# EAGLE design INJ4SS (EAGLE 6.5.0)
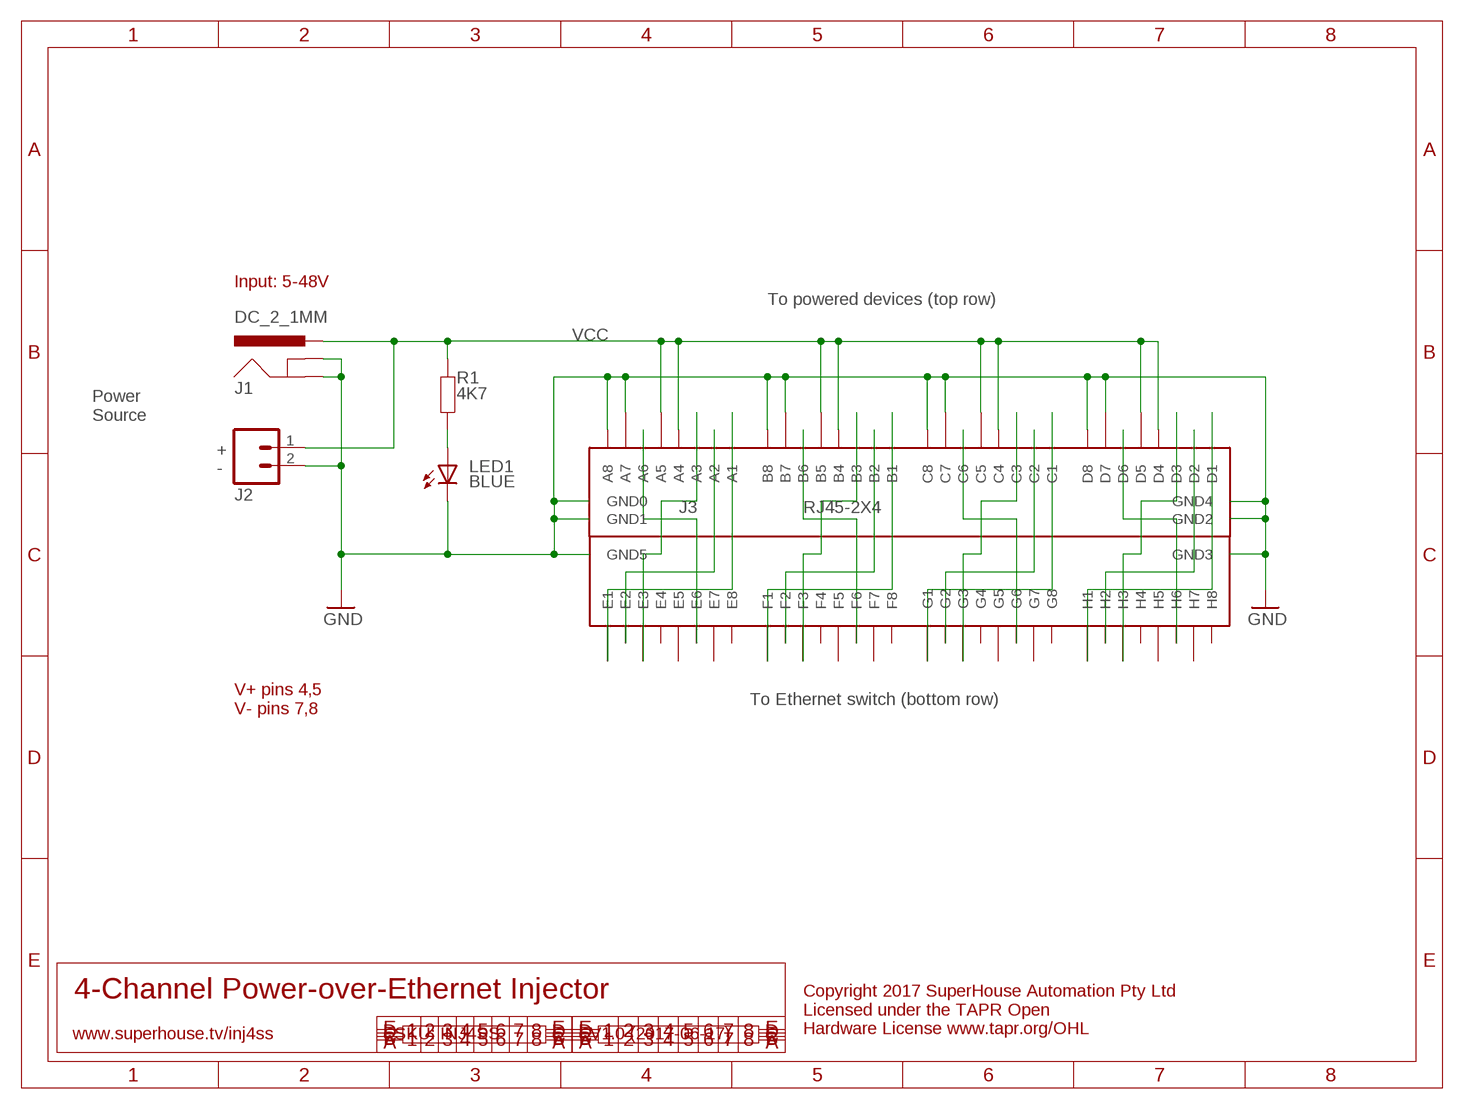
[diagram p0: schematic, sheet 1]

## Parts
J1  DC_2_1MM  POWER_JACKPTH  [POWER_JACK_PTH]
J2  M023.5MM  [SCREWTERMINAL-3.5MM-2]
J3  RJ45-2X4  [RJ45-2X4]
LED1  BLUE  LED3MM  [LED3MM]
R1  4K7  RESISTORPTH4  [RES-4]

## Nets
GND: J1.GND J1.GNDBREAK J2.2 J3.A7 J3.A8 J3.B7 J3.B8 J3.C7 J3.C8 J3.D7 J3.D8 J3.GND0 J3.GND1 J3.GND2 J3.GND3 J3.GND4 J3.GND5 LED1.K(C)
N$2: J3.B3 J3.F3
N$3: J3.B6 J3.F6
N$6: LED1.A R1.2
N$10: J3.B1 J3.F1
N$11: J3.B2 J3.F2
N$12: J3.C6 J3.G6
N$13: J3.D6 J3.H6
N$14: J3.C1 J3.G1
N$15: J3.C2 J3.G2
N$16: J3.C3 J3.G3
N$17: J3.D1 J3.H1
N$18: J3.D2 J3.H2
N$19: J3.D3 J3.H3
N$20: J3.A1 J3.E1
N$21: J3.A2 J3.E2
N$22: J3.A3 J3.E3
N$23: J3.A6 J3.E6
VCC: J1.PWR J2.1 J3.A4 J3.A5 J3.B4 J3.B5 J3.C4 J3.C5 J3.D4 J3.D5 R1.1
Unconnected: J3.E4 J3.E5 J3.E7 J3.E8 J3.F4 J3.F5 J3.F7 J3.F8 J3.G4 J3.G5 J3.G7 J3.G8 J3.H4 J3.H5 J3.H7 J3.H8

## Notes on the sheet
- Input: 5-48V
- To powered devices (top row)
- Power
  Source
- +
- -
- To Ethernet switch (bottom row)
- V+ pins 4,5
  V- pins 7,8
- 4-Channel Power-over-Ethernet Injector
- Copyright 2017 SuperHouse Automation Pty Ltd
  Licensed under the TAPR Open
  Hardware License www.tapr.org/OHL
- www.superhouse.tv/inj4ss | SKU: INJ4SS | V1.0 (2017-06-17)

## Library data of the parts
J1 = freetronics:POWER_JACK: Power Jack This is the standard 5.5mm barrel jack for power. The PTH is the most common, proven, reliable, footprint. All others are experimental. The Slot footprint only works if the mill layer is transmitted to the PCB fab house so be warned. Spark Fun Electronics SKU : PRT-00119. Mating wall wart : TOL-00298 (and others)
J2 = freetronics-jon:M02: Header 2 Standard 2-pin 0.1" header. Use with straight break away headers (SKU : PRT-00116), right angle break away headers (PRT-00553), swiss pins (PRT-00743), machine pins (PRT-00117), and female headers (PRT-00115). Molex polarized connector foot print use with SKU : PRT-08233 with associated crimp pins and housings.
J3 = freetronics-jon:RJ45-2X4
LED1 = freetronics-2:LED: LEDs Standard schematic elements and footprints for 5mm, 3mm, 1206, and 0603 sized LEDs. 5mm - Spark Fun Electronics SKU : COM-00529 (and others)
R1 = freetronics-2:RESISTOR: Resistor Basic schematic elements and footprints for 0603, 1206, and PTH 1/10th watt (small) resistors.

## Board
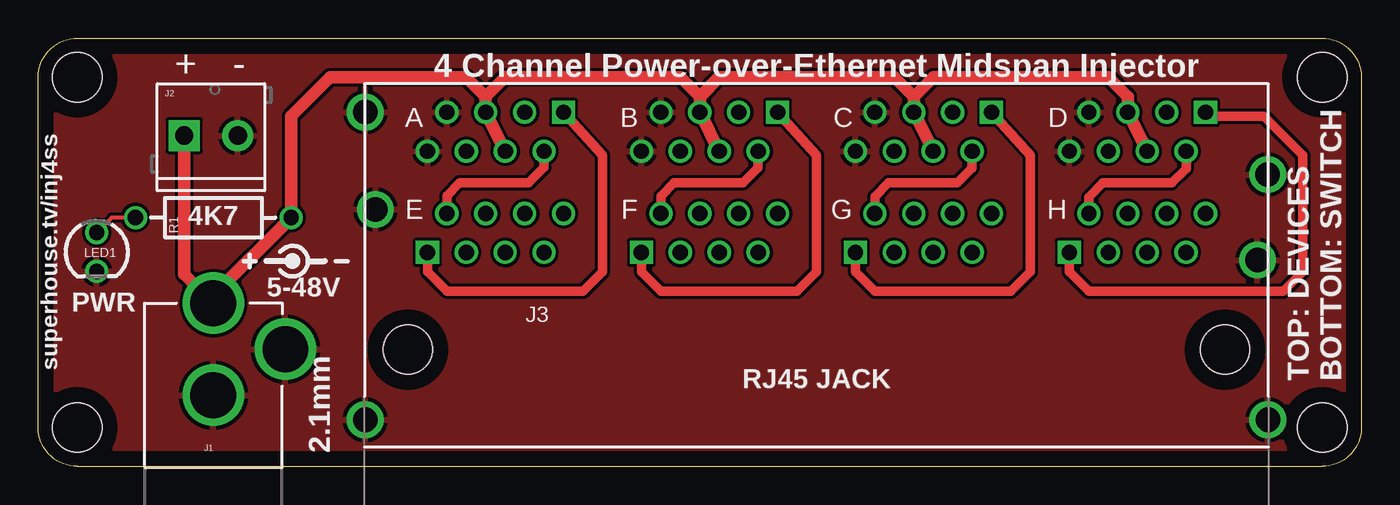
[diagram p1: board, top side]
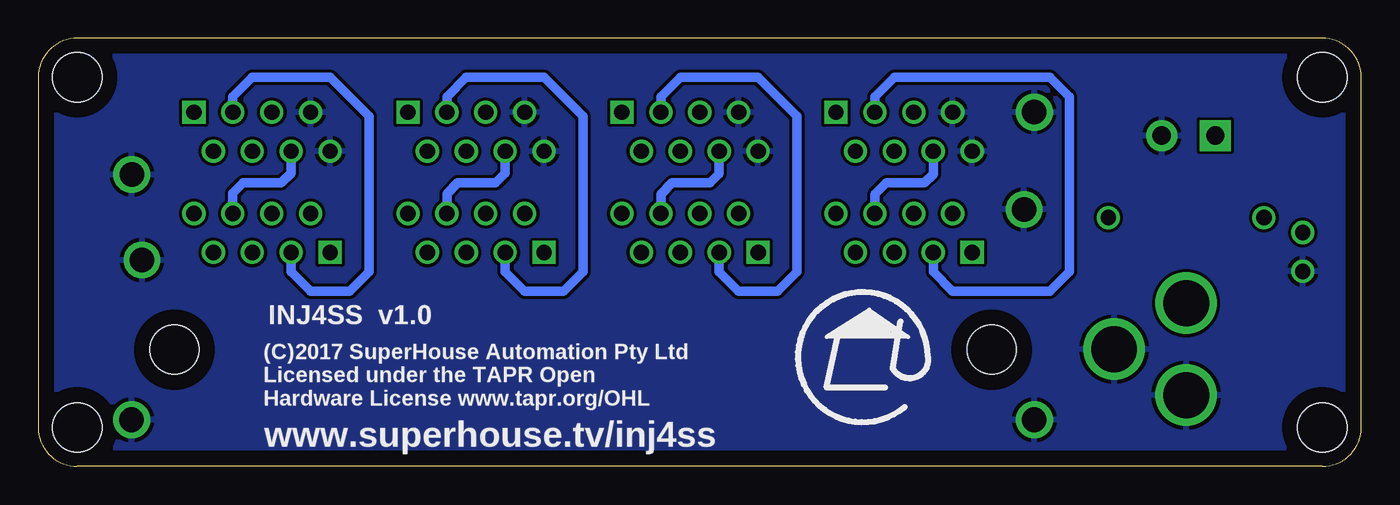
[diagram p2: board, bottom side, seen from below]

Size 86.36 x 27.94 mm. Coordinates in mm from the lower left corner, seen from the top.
Outline: 2.54,0 83.82,0 arc90 86.36,2.54 86.36,25.4 arc90 83.82,27.94 2.54,27.94 arc90 0,25.4 0,2.54 arc90 2.54,0
Copper layers (1*16): Top 0.035mm / dielectric 1.5mm / Bottom 0.035mm
Design rules "default": minimum track width 10mil, minimum drill 24mil, track to track 8mil, track to pad 8mil, pad to pad 8mil, via to via 8mil, smd to smd 8mil, copper to edge 40mil, drill to drill 8mil, minimum pad ring 10mil, minimum via ring 8mil, stop-mask expansion 4mil, vias tented up to drill 0mil, thermal gap 10mil
Holes 3.2 mm at 2.54,2.54 83.82,2.54 83.82,25.4 2.54,25.4

### Footprints (pad centres in the part's own frame; a part is rotated, then mirrored left to right if it is on the bottom)
POWER_JACK_PTH = drill 2.997: GND 0,7.7; GNDBREAK 4.7,10.7; PWR 0,13.7
SCREWTERMINAL-3.5MM-2 = drill 1.2 pad 2.032 square: 1 0,0 | drill 1.2 pad 2.032: 2 3.5,0
RJ45-2X4 = drill 1 square: A1 -16.51,15.49; B1 -2.54,15.49; C1 11.43,15.49; D1 25.4,15.49; E1 -25.4,6.35; F1 -11.43,6.35; G1 2.54,6.35; H1 16.51,6.35 | drill 1: A2 -17.78,12.95; A3 -19.05,15.49; A4 -20.32,12.95; A5 -21.59,15.49; A6 -22.86,12.95; A7 -24.13,15.49; A8 -25.4,12.95; B2 -3.81,12.95; B3 -5.08,15.49; B4 -6.35,12.95; B5 -7.62,15.49; B6 -8.89,12.95; B7 -10.16,15.49; B8 -11.43,12.95; C2 10.16,12.95; C3 8.89,15.49; C4 7.62,12.95; C5 6.35,15.49; C6 5.08,12.95; C7 3.81,15.49; C8 2.54,12.95; D2 24.13,12.95; D3 22.86,15.49; D4 21.59,12.95; D5 20.32,15.49; D6 19.05,12.95; D7 17.78,15.49; D8 16.51,12.95; E2 -24.13,8.89; E3 -22.86,6.35; E4 -21.59,8.89; E5 -20.32,6.35; E6 -19.05,8.89; E7 -17.78,6.35; E8 -16.51,8.89; F2 -10.16,8.89; F3 -8.89,6.35; F4 -7.62,8.89; F5 -6.35,6.35; F6 -5.08,8.89; F7 -3.81,6.35; F8 -2.54,8.89; G2 3.81,8.89; G3 5.08,6.35; G4 6.35,8.89; G5 7.62,6.35; G6 8.89,8.89; G7 10.16,6.35; G8 11.43,8.89; H2 17.78,8.89; H3 19.05,6.35; H4 20.32,8.89; H5 21.59,6.35; H6 22.86,8.89; H7 24.13,6.35; H8 25.4,8.89 | drill 1.6: GND0 29.464,-4.572; GND1 28.79,5.85; GND2 -29.46,15.5; GND3 -28.79,9.15; GND4 -29.464,-4.572; GND5 29.46,11.43 | hole 3.2: 26.67,0; -26.67,0
LED3MM = drill 1: A -1.27,0; K 1.27,0
RES-4 = drill 1: 1 -5.08,0; 2 5.08,0

### Placement (x,y rotation side)
J1  11.43,-3.05 0 top
J2  9.53,21.59 0 top
J3  50.8,7.62 0 top
LED1  3.81,14 270 top
R1  11.43,16.24 180 top

### Tracks (layer width: path | path; a pad name or v marks a point on that pad's centre or on a via)
GND
  pour Bottom: 0,2.54 0,25.4 arc-90 2.54,27.94 83.82,27.94 arc-90 86.36,25.4 86.36,2.54 arc-90 83.82,0 2.54,0 arc-90
  pour Top: 83.82,0 2.54,0 arc-90 0,2.54 0,25.4 arc-90 2.54,27.94 83.82,27.94 arc-90 86.36,25.4 86.36,2.54 arc-90
N$2
  Bottom 0.61: J3.B3 45.72,24.13 44.45,25.4 39.37,25.4 36.83,22.86 36.83,12.7 38.1,11.43 40.64,11.43 41.91,12.7 J3.F3
N$3
  Bottom 0.61: J3.F6 45.72,17.78 45,18.5 42.5,18.5 41.91,19.09 J3.B6
N$6
  Top 0.254: R1.2 4.78,16.24 LED1.A
N$10
  Top 0.61: J3.F1 39.37,12.7 40.64,11.43 49.53,11.43 50.8,12.7 50.8,20.32 J3.B1
N$11
  Top 0.61: J3.F2 40.64,17.64 41.5,18.5 46,18.5 46.99,19.49 J3.B2
N$12
  Bottom 0.61: J3.G6 59.69,17.81 59,18.5 56.5,18.5 55.88,19.12 J3.C6
N$13
  Bottom 0.61: J3.H6 73.66,17.84 73,18.5 70.5,18.5 69.85,19.15 J3.D6
N$14
  Top 0.61: J3.G1 53.34,12.7 54.61,11.43 63.5,11.43 64.77,12.7 64.77,20.32 J3.C1
N$15
  Top 0.61: J3.G2 54.61,17.61 55.5,18.5 60,18.5 60.96,19.46 J3.C2
N$16
  Bottom 0.61: J3.C3 59.69,24.13 58.42,25.4 53.34,25.4 50.8,22.86 50.8,12.7 52.07,11.43 54.61,11.43 55.88,12.7 J3.G3
N$17
  Top 0.305: 76.45,22.86 J3.D1
  Top 0.61: J3.H1 67.31,12.7 68.58,11.43 81.28,11.43 82.55,12.7 82.55,20.32 80.01,22.86 76.45,22.86
N$18
  Top 0.61: J3.H2 68.58,17.58 69.5,18.5 74,18.5 74.93,19.43 J3.D2
N$19
  Bottom 0.61: J3.D3 73.66,24.13 72.39,25.4 67.31,25.4 64.77,22.86 64.77,12.7 66.04,11.43 68.58,11.43 69.85,12.7 J3.H3
N$20
  Top 0.61: J3.E1 25.4,12.7 26.67,11.43 35.56,11.43 36.83,12.7 36.83,20.32 J3.A1
N$21
  Top 0.61: J3.E2 26.67,17.67 27.5,18.5 32,18.5 33.02,19.52 J3.A2
N$22
  Bottom 0.61: J3.A3 31.75,24.13 30.48,25.4 20.32,25.4 19.05,24.13 19.05,12.7 20.32,11.43 26.67,11.43 27.94,12.7 J3.E3
N$23
  Bottom 0.61: J3.E6 31.75,17.75 31,18.5 28.5,18.5 27.94,19.06 J3.A6
VCC
  Top 0.813: J3.C4 J3.C5 57.15,24.13 | J3.D4 J3.D5 71.12,24.13 69.85,25.4 58.42,25.4 57.15,24.13 | J3.B4 J3.B5 43.18,24.13 | J3.A4 J3.A5 29.21,24.13 | 43.18,24.13 44.45,25.4 55.88,25.4 57.15,24.13 | 29.21,24.13 30.48,25.4 41.91,25.4 43.18,24.13 | 29.21,24.13 27.94,25.4 19.05,25.4 16.51,22.86 R1.1 11.43,11.16 J1.PWR 9.53,12.56 J2.1

### Text on the board
tPlace: + | - | 4 Channel Power-over-Ethernet Midspan Injector | superhouse.tv/inj4ss | 5-48V | PWR | TOP: DEVICES / BOTTOM: SWITCH | RJ45 JACK | 2.1mm
bPlace: INJ4SS v1.0 | (C)2017 SuperHouse Automation Pty Ltd / Licensed under the TAPR Open / Hardware License www.tapr.org/OHL | www.superhouse.tv/inj4ss